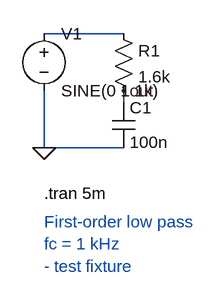
[diagram p0: schematic rc_lowpass.asc]
rc_lowpass.asc, the LTspice schematic file:
Version 4
SHEET 1 880 680
WIRE -96 16 16 16
WIRE 16 96 16 112
WIRE -96 96 -96 176
WIRE -96 176 16 176
FLAG -96 176 0
FLAG 16 96 out
SYMBOL voltage -96 0 R0
SYMATTR InstName V1
SYMATTR Value SINE(0 1 1k)
SYMBOL res 0 0 R0
SYMATTR InstName R1
SYMATTR Value 1.6k
SYMBOL cap 0 112 R0
SYMATTR InstName C1
SYMATTR Value 100n
TEXT -96 240 Left 2 !.tran 5m
TEXT -96 280 Left 2 ;First-order low pass\nfc = 1 kHz\n- test fixture

The netlist it stands for:
* rc_lowpass.asc
V1 N001 0 SINE(0 1 1k)
R1 N001 out 1.6k
C1 out 0 100n
.tran 5m
* First-order low pass
* fc = 1 kHz
* - test fixture
.backanno
.end